# EAGLE design schematic (EAGLE 7.6.0)
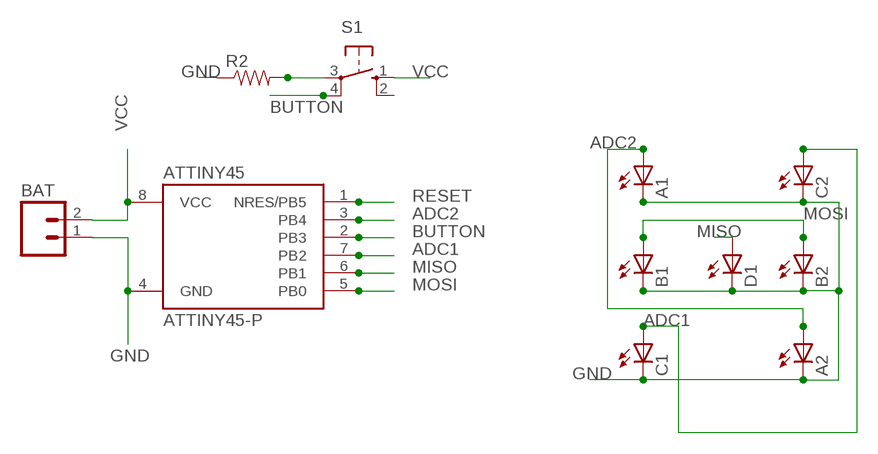
[diagram p0: schematic, sheet 1]

## Parts
A1  LED5MM  [LED5MM]
A2  LED5MM  [LED5MM]
ATTINY45  ATTINY45-P  [PDIP08_300MIL]
B1  LED5MM  [LED5MM]
B2  LED5MM  [LED5MM]
BAT  M02PTH  [1X02]
C1  LED5MM  [LED5MM]
C2  LED5MM  [LED5MM]
D1  LED5MM  [LED5MM]
R2  10KOHM-1/6W-5%(PTH)KIT  [AXIAL-0.3-KIT]
S1  40-XX  [B3F-40XX]

## Nets
ADC1: ATTINY45.7(PB2) C1.A C2.A
ADC2: A1.A A2.A ATTINY45.3(PB4)
BUTTON: ATTINY45.2(PB3) S1.4(P1)
GND: A1.K(C) A2.K(C) ATTINY45.4(GND) B1.K(C) B2.K(C) BAT.1 C1.K(C) C2.K(C) D1.K(C) R2.P$1
MISO: ATTINY45.6(PB1) D1.A
MOSI: ATTINY45.5(PB0) B1.A B2.A
N$1: R2.P$2 S1.3(P)
RESET: ATTINY45.1(NRES/PB5)
VCC: ATTINY45.8(VCC) BAT.2 S1.1(S)
Unconnected: S1.2(S1)

## Library data of the parts
A1 A2 B1 B2 C1 C2 D1 = led:LED: LED OSRAM: - CHIPLED LG R971, LG N971, LY N971, LG Q971, LY Q971, LO R971, LY R971 LH N974, LH R974 LS Q976, LO Q976, LY Q976 LO Q996 - Hyper CHIPLED LW Q18S LB Q993, LB Q99A, LB R99A - SideLED LS A670, LO A670, LY A670, LG A670, LP A670 LB A673, LV A673, LT A673, LW A673 LH A674 LY A675 LS A676, LA A676, LO A676, LY A676, LW A676 LS A679, LY A679, LG A679 - Hyper Micro SIDELED® LS Y876, LA Y876, LO Y876, LY Y876 LT Y87S - SmartLED LW L88C, LW L88S LB L89C, LB L89S, LG L890 LS L89K, LO L89K, LY L89K LS L896, LA L896, LO L896, LY L896 - TOPLED LS T670, LO T670, LY T670, LG T670, LP T670 LSG T670, LSP T670, LSY T670, LOP T670, LYG T670 LG T671, LOG T671, LSG T671 LB T673, LV T673, LT T673, LW T673 LH T674 LS T676, LA T676, LO T676, LY T676, LB T676, LH T676, LSB T676, LW T676 LB T67C, LV T67C, LT T67C, LS T67K, LO T67K, LY T67K, LW E67C LS E67B, LA E67B, LO E67B, LY E67B, LB E67C, LV E67C, LT E67C LW T67C LS T679, LY T679, LG T679 LS T770, LO T770, LY T770, LG T770, LP T770 LB T773, LV T773, LT T773, LW T773 LH T774 LS E675, LA E675, LY E675, LS T675 LS T776, LA T776, LO T776, LY T776, LB T776 LHGB T686 LT T68C, LB T68C - Hyper Mini TOPLED® LB M676 - Mini TOPLED Santana® LG M470 LS M47K, LO M47K, LY M47K Source: http://www.osram.convergy.de LUXEON: - LUMILED® LXK2-PW12-R00, LXK2-PW12-S00, LXK2-PW14-U00, LXK2-PW14-V00 LXK2-PM12-R00, LXK2-PM12-S00, LXK2-PM14-U00 LXK2-PE12-Q00, LXK2-PE12-R00, LXK2-PE12-S00, LXK2-PE14-T00, LXK2-PE14-U00 LXK2-PB12-K00, LXK2-PB12-L00, LXK2-PB12-M00, LXK2-PB14-N00, LXK2-PB14-P00, LXK2-PB14-Q00 LXK2-PR12-L00, LXK2-PR12-M00, LXK2-PR14-Q00, LXK2-PR14-R00 LXK2-PD12-Q00, LXK2-PD12-R00, LXK2-PD12-S00 LXK2-PH12-R00, LXK2-PH12-S00 LXK2-PL12-P00, LXK2-PL12-Q00, LXK2-PL12-R00 Source: www.luxeon.com KINGBRIGHT: KA-3528ASYC Source: www.kingbright.com
ATTINY45 = attiny25_45_85:ATTINY45*: ATMEL ATtiny 45 Packages: P = PDIP 08 30mil S = SOIC 08 EIAJ 208mil X = TSSOP 08 4.4mm Technologies Note: for complete ordering code (temp. range, finish, tape&reel etc.) see www.atmel.com • Supply Voltage: V = (1.8…5.5)V | [blank] = (2.7…5.5)V • Speed: 10 = 10 MHz | 20 = 20 MHz Author: Dipl.-Ing. FH Rainer Bayer HHN Hochschule Heilbronn (Heilbronn University), rainer.bayer@hs-heilbronn.de Ingenieurbüro ing-rb, mail@ing-rb.de
BAT = SparkFun-Connectors:M02: Standard 2-pin 0.1" header. Use with - straight break away headers ( PRT-00116) - right angle break away headers (PRT-00553) - swiss pins (PRT-00743) - machine pins (PRT-00117) - female headers (PRT-00115) Molex polarized connector foot print use with: PRT-08233 with associated crimp pins and housings. 2.54_SCREWTERM for use with PRT-10571. 3.5mm Screw Terminal footprints for PRT-08084 5mm Screw Terminal footprints for use with PRT-08432
R2 = SparkFun-Resistors:10KOHM-1/6W-5%(PTH): RES-08375; PROD_ID: RES-08375
S1 = switch-omron:40-XX: OMRON SWITCH; MF: OMRON COMPONENTS USA; MPN: B3F-4000; OC_FARNELL: 176434; OC_NEWARK: 36K3105

## Board
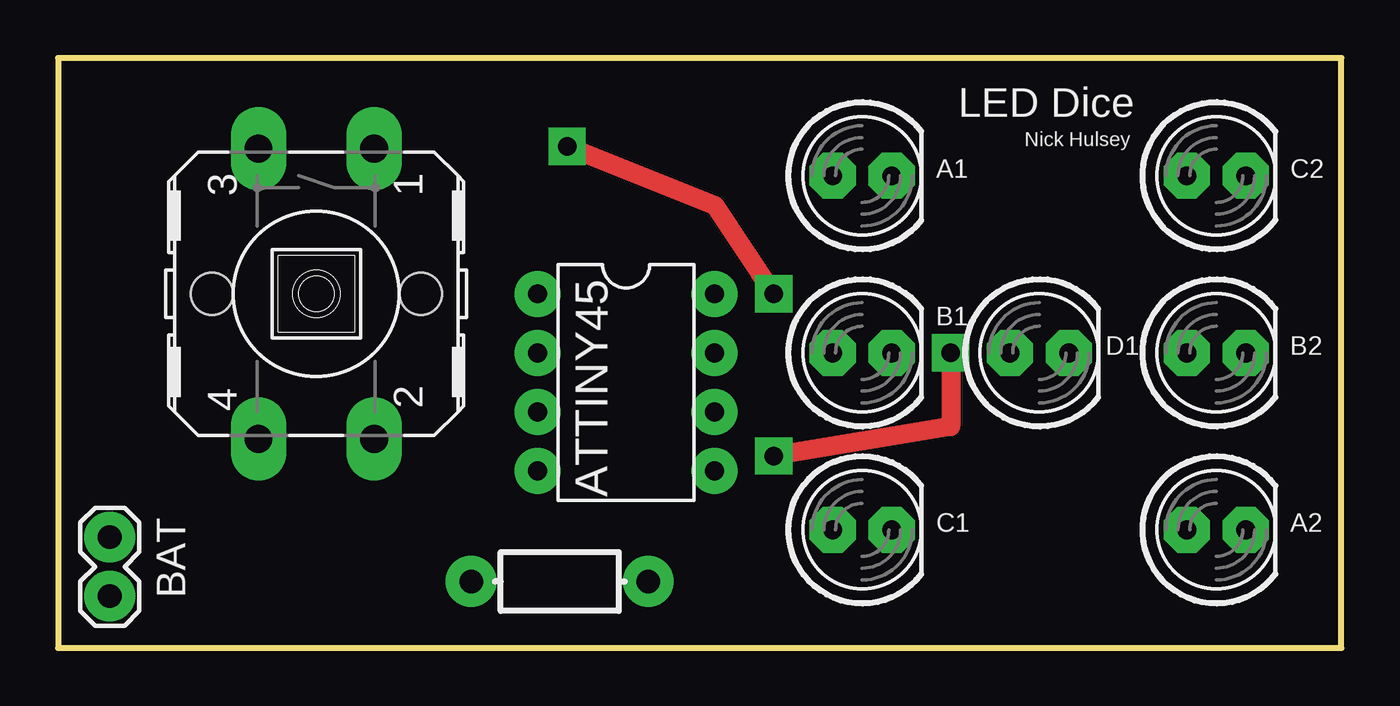
[diagram p1: board, top side]
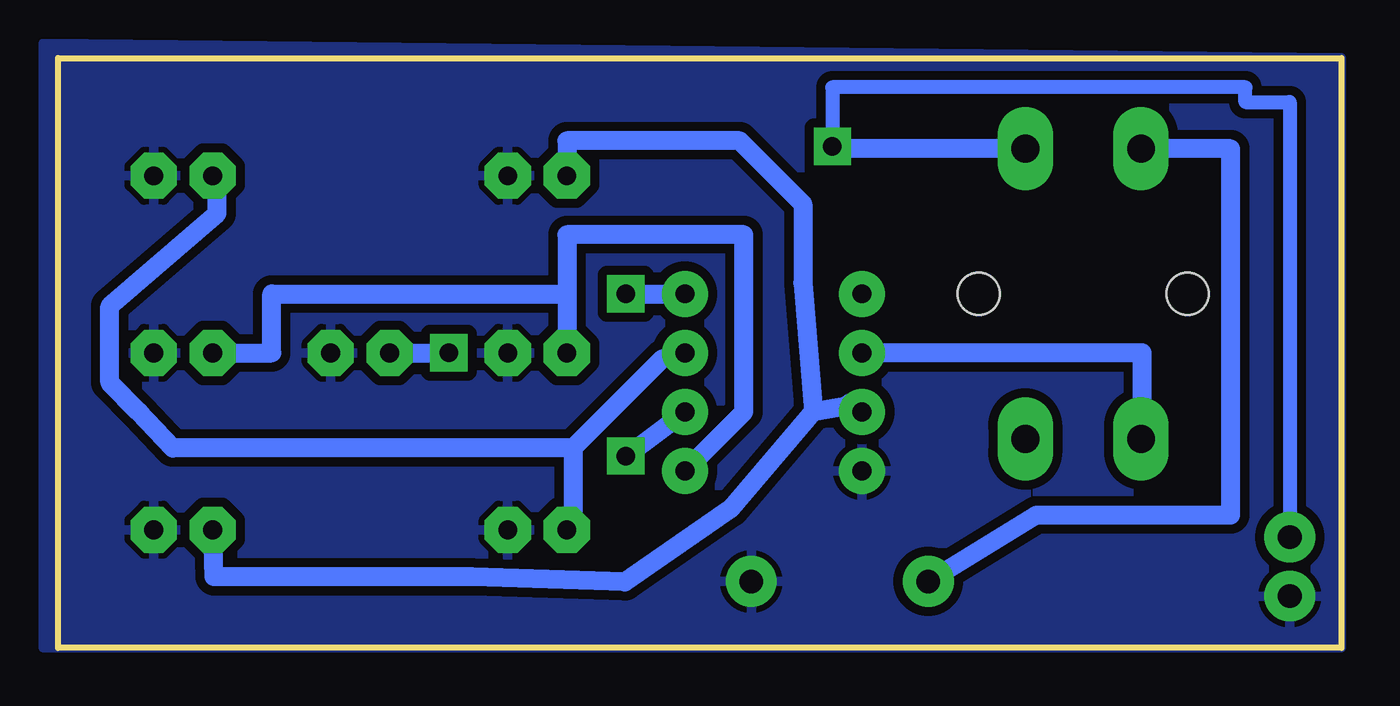
[diagram p2: board, bottom side, seen from below]

Size 55.23 x 25.39 mm. Coordinates in mm from the lower left corner, seen from the top.
Outline: 0,0 55.23,0 55.23,25.39 0,25.39 0,0
Copper layers (1*16): Top 0.035mm / dielectric 1.5mm / Bottom 0.035mm
Design rules "OthermillDRC_1_64_v2 *": minimum track width 16mil, minimum drill 31mil, track to track 0.39878125mm, track to pad 0.39878125mm, pad to pad 0.39878125mm, via to via 0.39878125mm, smd to smd 0mil, copper to edge 0mil, drill to drill 1mil, minimum pad ring 23mil, minimum via ring 15mil, stop-mask expansion 1mil, vias tented up to drill 30mil, thermal gap 10mil

### Footprints (pad centres in the part's own frame; a part is rotated, then mirrored left to right if it is on the bottom)
LED5MM = drill 0.813 octagon: A -1.27,0; K 1.27,0
PDIP08_300MIL = drill 0.813: 1 -3.81,-3.81; 2 -1.27,-3.81; 3 1.27,-3.81; 4 3.81,-3.81; 5 3.81,3.81; 6 1.27,3.81; 7 -1.27,3.81; 8 -3.81,3.81
1X02 = drill 1.016 pad 1.88: 1 0,0; 2 2.54,0
AXIAL-0.3-KIT = drill 1.016 pad 2.032: P$1 -3.81,0; P$2 3.81,0
B3F-40XX = drill 1.194 long: 1 -6.248,2.489; 2 6.248,2.489; 3 -6.248,-2.489; 4 6.248,-2.489 | hole 1.803: 0,-4.496; 0,4.496

### Placement (x,y rotation side)
A1  34.61,20.32 0 top
A2  49.85,5.08 0 top
ATTINY45  24.45,11.43 270 top
B1  34.61,12.7 0 top
B2  49.85,12.7 0 top
BAT  2.22,2.22 90 top
C1  34.61,5.08 0 top
C2  49.85,20.32 0 top
D1  42.23,12.7 0 top
R2  21.59,2.86 180 top
S1  11.11,15.24 270 top

### Tracks (layer width: path | path; a pad name or v marks a point on that pad's centre or on a via)
ADC1
  Bottom 0.813: 33.07,8.59 33.07,5.47 C1.A | 33.07,8.59 29.21,12.45 ATTINY45.7 | 33.07,8.59 50.29,8.59 51.75,10.16 53.01,11.42 53.01,14.71 48.39,18.7 48.39,19.93 C2.A
ADC2
  Bottom 0.813: 22.73,10.18 23.18,15.71 23.18,19.11 25.9,21.83 33.34,21.83 A1.A | 22.73,10.18 21.1,10.45 | 22.73,10.18 26.26,6.01 30.84,2.84 37.42,3.06 48.52,3.06 A2.A
  Bottom 1.016: 21.1,10.45 ATTINY45.3
BUTTON
  Bottom 0.813: S1.4 8.57,8.99 8.57,12.7 ATTINY45.2
GND
  pour Bottom: 0,0 55.88,0 55.88,26.04 0,25.4
MISO  (via drill 0.8)
  Top 0.813: v38.42,12.7 38.42,9.53 v30.8,8.25
  Bottom 0.813: D1.A v38.42,12.7 | v30.8,8.25 ATTINY45.6
MOSI
  Bottom 0.813: ATTINY45.5 25.72,10.16 25.72,17.78 33.34,17.78 33.34,15.24 | 33.34,15.24 B1.A | B2.A 46.04,12.7 46.04,15.24 33.34,15.24
N$1
  Bottom 0.813: R2.P$2 13.12,5.71 4.76,5.71 4.76,21.49 S1.3
VCC  (via drill 0.8, 0.8 pad 0.81)
  Top 0.813: v21.91,21.59 28.26,19.05 v30.8,15.24
  Bottom 0.61: v21.91,21.59 21.91,24.13 4.13,24.13 4.13,23.5 2.22,23.5 BAT.2
  Bottom 0.813: v30.8,15.24 ATTINY45.8 | S1.1 21.91,21.49 v21.91,21.59

### Text on the board
tNames: LED Dice | Nick Hulsey